# Altium project MODULIQ_PGA.PrjPcb (part 2 of 2)

## Sheet Power_Supply.SchDoc: PGA Supply
size A3; Author: M.Beldyga; CompanyName: WUT ISE; DrawnBy: M.Beldyga; Organization: WUT ISE; Address1: PW ISE; Address2: Nowowiejska 15/19 00-665 Warsaw; Address3: micbeldyga@gmail.com; SheetNumber: 3; SheetTotal: 3; ModifiedBy: -; CheckedDate: -; Title2: MODULIQ; DivGrp: WUT ISE; Designer: M.Beldyga; ModifiedDate: -; ProjectName: Sensor Box
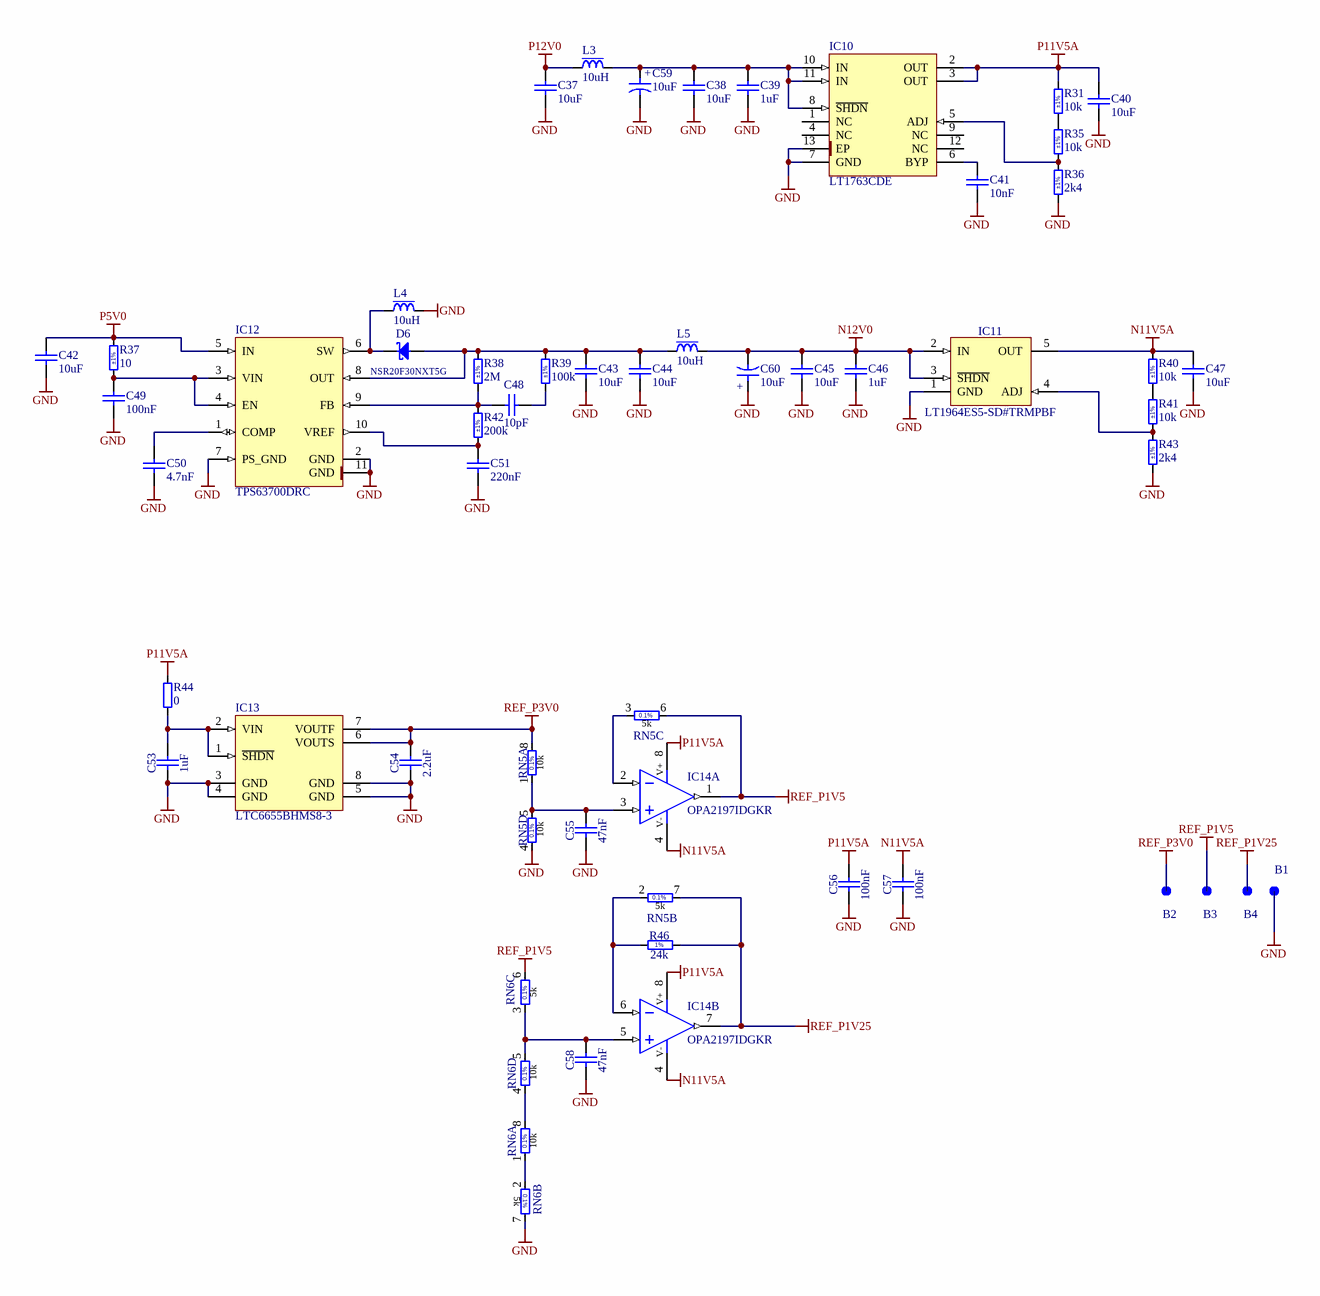
[diagram p2: Power_Supply.SchDoc]

### Parts
B1  SMD Pad  [C100]  (value not drawn)
B2  SMD Pad  [C100]  (value not drawn)
B3  SMD Pad  [C100]  (value not drawn)
B4  SMD Pad  [C100]  (value not drawn)
C37  10uF  [CAPC1709X100N]
C38  10uF  [CAPC1709X100N]
C39  1uF  [CAPC1608X87N]
C40  10uF  [CAPC1709X100N]
C41  10nF  [CAPC1005X55N]
C42  10uF  [CAPC1709X100N]
C43  10uF  [CAPC1709X100N]
C44  10uF  [CAPC1709X100N]
C45  10uF  [CAPC1709X100N]
C46  1uF  [CAPC1608X87N]
C47  10uF  [CAPC1709X100N]
C48  10pF  [CAPC1005X55N]
C49  100nF  [CAPC1005X55N]
C50  4.7nF  [CAPC1005X55N]
C51  220nF  [CAPC1005X55N]
C53  1uF  [CAPC1608X87N]
C54  2.2uF  [CAPC1608X87N]
C55  47nF  [CAPC2012X135N]
C56  100nF  [CAPC1005X55N]
C57  100nF  [CAPC1005X55N]
C58  47nF  [CAPC2012X135N]
C59  10uF  [CAPMP3216X180N]
C60  10uF  [CAPMP3216X180N]
D6  NSR20F30NXT5G  [DSN2]
IC10  LT1763CDE  [SON50P300X400X80-13N-R180X340]
IC11  LT1964ES5-SD#TRMPBF  [SOT95P280X100-5N]
IC12  TPS63700DRC  [TEXAS_DRC (S-PVSON-N10)]
IC13  LTC6655BHMS8-3  [SOP65P490X110-8N]
IC14  OPA2197IDGKR  [SOP65P490X110-8N]  (parts A,B of 2)
L3  10uH  [IND_WURTH_WE-TPC-2828]
L4  10uH  [IND_WURTH_WE-TPC-2828]
L5  10uH  [IND_WURTH_WE-TPC-2828]
R31  10k  Tolerance: ±1%  [RESC1005X40N]
R35  10k  Tolerance: ±1%  [RESC1005X40N]
R36  2k4  Tolerance: ±1%  [RESC1005X40N]
R37  10  Tolerance: ±1%  [RESC1005X40N]
R38  2M  Tolerance: ±1%  [RESC1005X40N]
R39  100k  Tolerance: ±1%  [RESC1005X40N]
R40  10k  Tolerance: ±1%  [RESC1005X40N]
R41  10k  Tolerance: ±1%  [RESC1005X40N]
R42  200k  Tolerance: ±1%  [RESC1005X40N]
R43  2k4  Tolerance: ±1%  [RESC1005X40N]
R44  0  [RESC1005X40N]
R46  24k  [RESC1608X55N]
RN5  10k 5K 5K 10K  [SOIC127P600X175-8N]  (value not drawn)  (parts A,B,C,D of 4)
RN6  10k 5K 5K 10K  [SOIC127P600X175-8N]  (value not drawn)  (parts A,B,C,D of 4)

### Nets
GND: B1.1 C37.1 C38.1 C39.1 C40.1 C41.1 C42.1 C43.1 C44.1 C45.1 C46.1 C47.1 C49.1 C50.1 C51.1 C53.1 C54.1 C55.1 C56.1 C57.1 C58.1 C59.2 C60.1 IC10.7(GND) IC10.13(EP) IC11.1(GND) IC12.2(GND) IC12.7(PS_GND) IC12.11(GND) IC13.3(GND) IC13.4(GND) IC13.5(GND) IC13.8(GND) L4.2 R36.1 R43.1 RN5.4 RN6.7
N11V5A: C47.2 C57.2 IC11.5(OUT) IC14.4(V-) R40.2
N12V0: C45.2 C46.2 C60.2 IC11.2(IN) IC11.3(~{SHDN}) L5.2
P5V0: C42.2 IC12.5(IN) R37.2
P11V5A: C40.2 C56.2 IC10.2(OUT) IC10.3(OUT) IC14.8(V+) R31.2 R44.1
P12V0: C37.2 L3.1
REF_P1V5: B3.1 IC14.1(OUT) RN5.6 RN6.6
REF_P1V25: B4.1 IC14.7(OUT) R46.2 RN5.7
REF_P3V0: B2.1 C54.2 IC13.6(VOUTS) IC13.7(VOUTF) RN5.8
NetC38_2: C38.2 C39.2 C59.1 IC10.8(~{SHDN}) IC10.10(IN) IC10.11(IN) L3.2
NetC41_2: C41.2 IC10.6(BYP)
NetC43_2: C43.2 C44.2 D6.2(A) IC12.8(OUT) L5.1 R38.1 R39.2
NetC48_1: C48.1 IC12.9(FB) R38.2 R42.2
NetC48_2: C48.2 R39.1
NetC49_2: C49.2 IC12.3(VIN) IC12.4(EN) R37.1
NetC50_2: C50.2 IC12.1(COMP)
NetC51_2: C51.2 IC12.10(VREF) R42.1
NetC53_2: C53.2 IC13.1(~{SHDN}) IC13.2(VIN) R44.2
NetC55_2: C55.2 IC14.3(IN+) RN5.1 RN5.5
NetC58_2: C58.2 IC14.5(IN+) RN6.3 RN6.5
NetD6_1: D6.1(C) IC12.6(SW) L4.1
NetIC10_5: IC10.5(ADJ) R35.1 R36.2
NetIC11_4: IC11.4(ADJ) R41.1 R43.2
NetIC14_2: IC14.2(IN-) RN5.3
NetIC14_6: IC14.6(IN-) R46.1 RN5.2
NetR31_1: R31.1 R35.2
NetR40_1: R40.1 R41.2
NetRN6_1: RN6.1 RN6.2
NetRN6_4: RN6.4 RN6.8

Not connected (* = marked no-connect by the designer): IC10 1(NC) 4(NC) 9(NC) 12(NC)

### Notes on the sheet
- Project/Equipment
- Document
- Designer
- Drawn by
- Check.by
- Contact
- File
- Last Mod.
- Print Date
- Sheet
- Size
- A3
- of
- Rev
- (in symbol CTE3216-18_10UF_16V_20%_AVX_TCJ) +
- (in symbol R0603_24K_1%_0.1W_100PPM) 1%
- (in symbol RN_10K_5K_VISHAY_AORN2-1AT3, part A) 10k
- (in symbol RN_10K_5K_VISHAY_AORN2-1AT3, part B) 5k
- (in symbol RN_10K_5K_VISHAY_AORN2-1AT3, part C) 5k
- (in symbol RN_10K_5K_VISHAY_AORN2-1AT3, part D) 10k

### Library data of the parts
B1-B4 = SMD_PAD_D1MM: Pad; Part Description: 1mm Diameter SMD Pad; Mounted: No; Part Number: SMD_PAD_D1MM; Component Kind: Standard (No BOM); Component Type: Standard (No BOM); Pin Count: 1; Family: SMD Pad; Socket: No; SMD: Yes; Sense: No; Status: None; ComponentHeight: 0mm; HelpURL: Undefined; Author: CERN DEM JLC; CreateDate: 10/10/2017; LatestRevisionDate: 10/10/2017; PackageDescription: 1mm Diameter SMD Pad
C37 C38 C40 C42-C45 C47 = CC0603_10UF_25V_20%_X5R: Non-polarised capacitor; Part Description: SMD Multilayer Chip Ceramic Capacitor; Manufacturer: GENERIC; Manufacturer1 Part Number: C1608X5R1E106M080; Voltage: 25V; TC: X5R; Tolerance: ±20%; Part Number: CC0603_10UF_25V_20%_X5R; Component Kind: Standard; Component Type: Standard; Pin Count: 2; Value: 10uF; Status: None; Manufacturer Part Number: CC0603_10UF_25V_20%_X5R; Case: 0603; Mounted: Yes; Socket: No; SMD: Yes; Sense: No; Manufacturer1 Example: TDK; Manufacturer1 ComponentHeight: 1mm; HelpURL: \\cern.ch\dfs\Applications\Altium\Datasheets\CC0603_X5R_TDK_C.pdf; Author: CERN DEM BC; CreateDate: 7/1/2020; LatestRevisionDate: 7/1/2020
C39 C46 C53 = CC0603_1UF_25V_10%_X7R: Non-polarised capacitor; Part Description: SMD Multilayer Chip Ceramic Capacitor; Manufacturer: GENERIC; Manufacturer1 Part Number: GRM188R71E105KA12D; Voltage: 25V; TC: X7R; Tolerance: ±10%; Part Number: CC0603_1UF_25V_10%_X7R; Component Kind: Standard; Component Type: Standard; Pin Count: 2; Value: 1uF; Status: None; Manufacturer Part Number: CC0603_1UF_25V_10%_X7R; Case: 0603; Mounted: Yes; Socket: No; SMD: Yes; Sense: No; Manufacturer1 Example: MURATA; Manufacturer1 ComponentHeight: 0.9mm; HelpURL: \\cern.ch\dfs\Applications\Altium\Datasheets\CC0603_X7R_MURATA.pdf; Author: CERN DEM JLC
  C39 C46: CreateDate: 1/18/2011; LatestRevisionDate: 1/18/2011
  C53: CreateDate: 18.01.2011; LatestRevisionDate: 18.01.2011
C41 = CC0402_10NF_50V_5%_X7R: Non-polarised capacitor; Part Description: SMD Multilayer Chip Ceramic Capacitor; Manufacturer: GENERIC; Manufacturer1 Part Number: C0402C103J5RAC; Voltage: 50V; TC: X7R; Tolerance: ±5%; Part Number: CC0402_10NF_50V_5%_X7R; Component Kind: Standard; Component Type: Standard; Pin Count: 2; Value: 10nF; Status: Preferred; Manufacturer Part Number: CC0402_10NF_50V_5%_X7R; Case: 0402; Mounted: Yes; Socket: No; SMD: Yes; Sense: No; Manufacturer1 Example: KEMET; Manufacturer1 ComponentHeight: 0.55mm; HelpURL: \\cern.ch\dfs\Applications\Altium\Datasheets\CC0402_X7R_KEMET.pdf; Author: CERN DEM BC; CreateDate: 7/15/2020; LatestRevisionDate: 7/15/2020
C48 = CC0402_10PF_50V_5%_C0G: Non-polarised capacitor; Part Description: SMD Multilayer Chip Ceramic Capacitor; Manufacturer: GENERIC; Manufacturer1 Part Number: C0402C100J5GACTU; Voltage: 50V; TC: C0G/NP0; Tolerance: ±5%; Part Number: CC0402_10PF_50V_5%_C0G; Component Kind: Standard; Component Type: Standard; Pin Count: 2; Value: 10pF; Status: Preferred; Manufacturer Part Number: CC0402_10PF_50V_5%_C0G; Case: 0402; Mounted: Yes; Socket: No; SMD: Yes; Sense: No; Manufacturer1 Example: KEMET; Manufacturer1 ComponentHeight: 0.55mm; HelpURL: \\cern.ch\dfs\Applications\Altium\Datasheets\CC0402_C0G_KEMET_(Commercial Grade).pdf; Author: CERN DEM JLC; CreateDate: 12/3/2007; LatestRevisionDate: 4/22/2015
C49 = CC0402_100NF_50V_10%_X7R: Non-polarised capacitor; Part Description: SMD Multilayer Chip Ceramic Capacitor; Manufacturer: GENERIC; Manufacturer1 Part Number: GRM155R71H104KE14D; Voltage: 50V; TC: X7R; Tolerance: ±10%; Part Number: CC0402_100NF_50V_10%_X7R; Component Kind: Standard; Component Type: Standard; Pin Count: 2; Value: 100nF; Status: None; Manufacturer Part Number: CC0402_100NF_50V_10%_X7R; Case: 0402; Mounted: Yes; Socket: No; SMD: Yes; Sense: No; Manufacturer1 Example: MURATA; Manufacturer1 ComponentHeight: 0.55mm; HelpURL: \\cern.ch\dfs\Applications\Altium\Datasheets\CC0402_MURATA_GRM155R71H104KE14D.pdf; Author: CERN DEM MR; CreateDate: 6/30/2017; LatestRevisionDate: 6/30/2017
C50 = CC0402_4.7NF_16V_10%_X7R: Non-polarised capacitor; Part Description: SMD Multilayer Chip Ceramic Capacitor; Manufacturer: GENERIC; Manufacturer1 Part Number: 223878715632; Voltage: 16V; TC: X7R; Tolerance: ±10%; Part Number: CC0402_4.7NF_16V_10%_X7R; Component Kind: Standard; Component Type: Standard; Pin Count: 2; Value: 4.7nF; Status: Not Recommended; Manufacturer Part Number: CC0402_4.7NF_16V_10%_X7R; Case: 0402; Mounted: Yes; Socket: No; SMD: Yes; Sense: No; Manufacturer1 Example: PHYCOMP; Manufacturer1 ComponentHeight: 0.55mm; HelpURL: \\cern.ch\dfs\Applications\Altium\Datasheets\CC0402_X7R_PHYCOMP.pdf; Author: CERN DEM JLC; CreateDate: 12/3/2007; LatestRevisionDate: 12/3/2007
C51 = CC0402_220NF_35V_10%_X7R: Non-polarised capacitor; Part Description: SMD Multilayer Chip Ceramic Capacitor; Manufacturer: GENERIC; Manufacturer1 Part Number: CGA2B1X7R1V224K050; Voltage: 35V; TC: X7R; Tolerance: ±10%; Part Number: CC0402_220NF_35V_10%_X7R; Component Kind: Standard; Component Type: Standard; Pin Count: 2; Value: 220nF; Status: None; Manufacturer Part Number: CC0402_220NF_35V_10%_X7R; Case: 0402; Mounted: Yes; Socket: No; SMD: Yes; Sense: No; Manufacturer1 Example: TDK; Manufacturer1 ComponentHeight: 0.55mm; HelpURL: \\cern.ch\dfs\Applications\Altium\Datasheets\CC0402_X7R_TDK_CGA.pdf; Author: CERN DEM HF; CreateDate: 11/9/2023; LatestRevisionDate: 11/9/2023
C54 = CC0603_2.2UF_16V_10%_X5R: Non-polarised capacitor; Part Description: SMD Multilayer Chip Ceramic Capacitor; Manufacturer: GENERIC; Manufacturer1 Part Number: CC0603KRX5R7BB225; Voltage: 16V; TC: X5R; Tolerance: ±10%; Part Number: CC0603_2.2UF_16V_10%_X5R; Component Kind: Standard; Component Type: Standard; Pin Count: 2; Value: 2.2uF; Status: Preferred; Manufacturer Part Number: CC0603_2.2UF_16V_10%_X5R; Case: 0603; Mounted: Yes; Socket: No; SMD: Yes; Sense: No; Manufacturer1 Example: YAGEO; Manufacturer1 ComponentHeight: 0.9mm; HelpURL: \\cern.ch\dfs\Applications\Altium\Datasheets\CC0805_X5R_PHYCOMP_HC.pdf; Author: CERN DEM JLC; CreateDate: 28.04.2011; LatestRevisionDate: 28.04.2011
C55 C58 = CC0805_47NF_25V_5%_C0G: Non-polarised capacitor; Part Description: SMD Multilayer Chip Ceramic Capacitor; Manufacturer: GENERIC; Manufacturer1 Part Number: C0805C473J3GACTU; Voltage: 25V; TC: C0G/NP0; Tolerance: ±5%; Part Number: CC0805_47NF_25V_5%_C0G; Component Kind: Standard; Component Type: Standard; Pin Count: 2; Value: 47nF; Status: None; Manufacturer Part Number: CC0805_47NF_25V_5%_C0G; Case: 0805; Mounted: Yes; Socket: No; SMD: Yes; Sense: No; Manufacturer1 Example: KEMET; Manufacturer1 ComponentHeight: 1.4mm; HelpURL: \\cern.ch\dfs\Applications\Altium\Datasheets\CC0805_C0G_KEMET_(Commercial Grade).pdf; Author: CERN DEM JLC; CreateDate: 18.01.2011; LatestRevisionDate: 18.01.2011
C56 C57 = CC0402_100NF_16V_10%_X5R: Non-polarised capacitor; Part Description: SMD Multilayer Chip Ceramic Capacitor; Manufacturer: GENERIC; Manufacturer1 Part Number: GRM155R61C104KA88D; Voltage: 16V; TC: X5R; Tolerance: ±10%; Part Number: CC0402_100NF_16V_10%_X5R; Component Kind: Standard; Component Type: Standard; Pin Count: 2; Value: 100nF; Status: None; Manufacturer Part Number: CC0402_100NF_16V_10%_X5R; Case: 0402; Mounted: Yes; Socket: No; SMD: Yes; Sense: No; Manufacturer1 Example: MURATA; Manufacturer1 ComponentHeight: 0.55mm; HelpURL: \\cern.ch\dfs\Applications\Altium\Datasheets\CC0402_X5R_MURATA_GRM.pdf; Author: CERN DEM JLC; CreateDate: 10.12.2013; LatestRevisionDate: 10.12.2013
C59 C60 = CTE3216-18_10UF_16V_20%_AVX_TCJ: Polarised capacitor; Part Description: ESR 0R200 Tantalum Solid Electrolytic Chip Capacitor with Conductive Polymer Electrode; Manufacturer: AVX; Manufacturer Part Number: TCJA106M016R0200; Voltage: 16V; Tolerance: ±20%; Part Number: CTE3216-18_10UF_16V_20%_AVX_TCJ; Component Kind: Standard; Component Type: Standard; Pin Count: 2; Value: 10uF; Status: Preferred; Case: A; Mounted: Yes; Socket: No; SMD: Yes; Sense: No; ComponentHeight: 1.8mm; HelpURL: \\cern.ch\dfs\Applications\Altium\Datasheets\CTE_AVX_TCJ.pdf; Author: CERN DEM JLC; CreateDate: 29.03.2012; LatestRevisionDate: 29.03.2012
D6 = NSR20F30NXT5G: Schottky Diode; Part Description: Diode 30 V 2A Surface Mount 2-DSN (1.6x.80); Manufacturer: onsemi; Arena Part Number: 140-000035; Part Number: NSR20F30NXT5G; Component Kind: Standard; Component Type: Standard; Device: NSR20F30NXT5G; PackageDescription: 1.6x0.8, 0.9P, (0603) CASE 152AB; Manufacturer Part Number: NSR20F30NXT5G; Pin Count: 2; Case: DSN2; Status: Active; Author: Michal Beldyga; CreateDate: 8/5/2025; LastRevision: 8/8/2025
IC10 = LT1763CDE: 1.22V to 20V 500mA, Low Noise, LDO Adjustable Micropower Regulator; Part Description: 1.22V to 20V, 500mA, Low Noise, LDO Adjustable Micropower Regulator; Manufacturer: LINEAR TECHNOLOGY; PressFit: No; Bonding: No; Part Number: LT1763CDE; Component Kind: Standard; Component Type: Standard; Device: LT1763CDE; PackageDescription: SON, (DFN) 0.50mm Pitch; 12 Pin, 3.00mm W X 4.00mm L X 0.80mm H body (w/Thermal Tab 1.80 X 3.40mm), IPC Medium Density; Manufacturer Part Number: LT1763CDE; Pin Count: 13; Case: SON12; Mounted: Yes; Socket: No; SMD: Yes; Sense: No; ComponentHeight: 0.8mm; HelpURL: \\cern.ch\dfs\Applications\Altium\Datasheets\LT1763.pdf; Author: CERN DEM HF; CreateDate: 4/25/2023; LatestRevisionDate: 4/25/2023
IC11 = LT1964ES5-SD#TRMPBF: 200mA, Low Noise, Low Dropout Negative Micropower Regulator; Part Description: -1.22V to -20V, 200mA, Low Noise, Low Dropout Negative Micropower Regulator; Manufacturer: LINEAR TECHNOLOGY; PressFit: No; Bonding: No; Part Number: LT1964ES5-SD#TRMPBF; Component Kind: Standard; Component Type: Standard; Device: LT1964ES5-SD#TRMPBF; PackageDescription: SOT23, 0.95mm pitch; 5 pin, 1.75mm W X 3.00mm L, IPC Medium Density; Manufacturer Part Number: LT1964ES5-SD#TRMPBF; Pin Count: 5; Case: SOT23-5; Mounted: Yes; Socket: No; SMD: Yes; Sense: No; ComponentHeight: 1mm; HelpURL: \\cern.ch\dfs\Applications\Altium\Datasheets\LT1964ES5-SD#TRMPBF.pdf; Author: CERN DEM JLC; CreateDate: 05.05.2009; LatestRevisionDate: 05.05.2009
IC12 = TPS63700DRC: DC-DC Inverter; Manufacturer: TEXAS INSTRUMENTS; PressFit: No; Bonding: No; Part Number: TPS63700DRC; Component Kind: Standard; Component Type: Standard; Device: TPS63700DRC; PackageDescription: TEXAS Case Style DRC (S-PVSON-N10), SON, 0.50mm Pitch; 10 Pin, 3.00mm W  X 3.00mm L X 1.00mm H body, (w/Thermal Tab 1.75 X 2.50 mm); Part Description: DC-DC Inverter; Manufacturer Part Number: TPS63700DRC; Pin Count: 11; Case: SON10; Mounted: Yes; Socket: No; SMD: Yes; Sense: No; ComponentHeight: 1mm; HelpURL: \\cern.ch\dfs\Applications\Altium\Datasheets\TPS63700DRC.pdf; Author: CERN DEM BC; CreateDate: 5/18/2020; LatestRevisionDate: 5/18/2020
IC13 = LTC6655BHMS8-3: 0.25ppm Noise, Low Drift Precision Buffered Voltage Reference; Part Description: 3V, 0.25ppm Noise, Low Drift Precision Buffered Voltage Reference; Manufacturer: ANALOG DEVICES; PressFit: No; Bonding: No; Part Number: LTC6655BHMS8-3; Component Kind: Standard; Component Type: Standard; Device: LTC6655BHMS8-3; PackageDescription: SOP, 8-Leads, Body 3.1x3.1mm (max), Pitch 0.65mm, IPC Medium Density; Manufacturer Part Number: LTC6655BHMS8-3; Pin Count: 8; Case: SSOP8; Mounted: Yes; Socket: No; SMD: Yes; Sense: No; ComponentHeight: 1.1mm; HelpURL: \\cern.ch\dfs\Applications\Altium\Datasheets\LTC6655BHMS8-3.pdf; Author: CERN DEM HF; CreateDate: 12/13/2021; LatestRevisionDate: 12/13/2021
IC14 = OA_OPA2197IDGKR: 36-V, Precision, Rail-to-Rail Input Output, Low Offset Voltage Op Amp 8-VSSOP; Part Description: High-Precision, Low-Noise, Rail-to-Rail Output,10-MHz Op Amp; Manufacturer: TEXAS INSTRUMENTS; PressFit: No; Bonding: No; Part Number: OPA2197IDGKR; Component Kind: Standard; Component Type: Standard; Device: OPA2197IDGKR; PackageDescription: SOP, 0.65mm pitch; 8 pin, 3.00mm W X 3.00mm L X 1.10mm H body, IPC Medium Density; Manufacturer Part Number: OPA2197IDGKR; Pin Count: 8; Case: MSOP8; Mounted: Yes; Socket: No; SMD: Yes; Sense: No; ComponentHeight: 1.1mm; Author: GK; HelpURL: \\cern.ch\dfs\Applications\Altium\Datasheets\OPA2140AIDGK.pdf; CreateDate: 20.04.2017; LatestRevisionDate: 20.04.2017
L3-L5 = IND_10UH_20%_WURTH_WE-TPC_744025100: Inductor With Core; Part Description: Shielded Tiny Power Inductor (WE-TPC Series); Manufacturer: WURTH ELEKTRONIK; Power: 1A; Resistance: 0.17R; Tolerance: ±20%; Part Number: IND_10UH_20%_WURTH_WE-TPC_744025100; Component Kind: Standard; Component Type: Standard; Pin Count: 2; Value: 10uH; Manufacturer Part Number: 744025100; Mounted: Yes; Socket: No; SMD: Yes; Sense: No; ComponentHeight: 3mm; HelpURL: \\cern.ch\dfs\Applications\Altium\Datasheets\IND_WURTH_WE-TPC_744025100.pdf; Author: CERN DEM BC; CreateDate: 7/29/2020; LatestRevisionDate: 7/29/2020
R31 R35 R40 R41 = R0402_10K_1%_0.0625W_100PPM: Resistor - 1%; Part Description: General Purpose Thick Film Chip Resistor; Manufacturer: GENERIC; Manufacturer1 Part Number: 232270671003L; TC: ±100ppm/°C; PressFit: No; Part Number: R0402_10K_1%_0.0625W_100PPM; Component Kind: Standard; Component Type: Standard; Pin Count: 2; Value: 10k; Status: Not Recommended; Power: 0.0625W; Manufacturer Part Number: R0402_10K_1%_0.0625W_100PPM; Case: 0402; Mounted: Yes; Sense: No; Socket: No; SMD: Yes; Manufacturer1 Example: YAGEO PHYCOMP; Manufacturer1 ComponentHeight: 0.4mm; HelpURL: \\cern.ch\dfs\Applications\Altium\Datasheets\R0402_Phycomp_RC0402.pdf; Author: CERN DEM JLC; CreateDate: 12/3/2007; LatestRevisionDate: 10/17/2012
R36 R43 = R0402_2K4_1%_0.0625W_100PPM: Resistor - 1%; Part Description: General Purpose Thick Film Chip Resistor; Manufacturer: GENERIC; Manufacturer1 Part Number: 232270672402L; TC: ±100ppm/°C; PressFit: No; Part Number: R0402_2K4_1%_0.0625W_100PPM; Component Kind: Standard; Component Type: Standard; Pin Count: 2; Value: 2k4; Status: Not Recommended; Power: 0.0625W; Manufacturer Part Number: R0402_2K4_1%_0.0625W_100PPM; Case: 0402; Mounted: Yes; Sense: No; Socket: No; SMD: Yes; Manufacturer1 Example: YAGEO PHYCOMP; Manufacturer1 ComponentHeight: 0.4mm; HelpURL: \\cern.ch\dfs\Applications\Altium\Datasheets\R0402_Phycomp_RC0402.pdf; Author: CERN DEM JLC; CreateDate: 12/3/2007; LatestRevisionDate: 10/17/2012
R37 = R0402_10R_1%_0.0625W_200PPM: Resistor - 1%; Part Description: General Purpose Thick Film Chip Resistor; Manufacturer: GENERIC; Manufacturer1 Part Number: 232270671009L; TC: ±200ppm/°C; PressFit: No; Part Number: R0402_10R_1%_0.0625W_200PPM; Component Kind: Standard; Component Type: Standard; Pin Count: 2; Value: 10; Status: Not Recommended; Power: 0.0625W; Manufacturer Part Number: R0402_10R_1%_0.0625W_200PPM; Case: 0402; Mounted: Yes; Sense: No; Socket: No; SMD: Yes; Manufacturer1 Example: YAGEO PHYCOMP; Manufacturer1 ComponentHeight: 0.4mm; HelpURL: \\cern.ch\dfs\Applications\Altium\Datasheets\R0402_Phycomp_RC0402.pdf; Author: CERN DEM JLC; CreateDate: 6/24/2009; LatestRevisionDate: 10/17/2012
R38 = R0402_2M_1%_0.0625W_100PPM: Resistor - 1%; Part Description: General Purpose Thick Film Chip Resistor; Manufacturer: GENERIC; Manufacturer1 Part Number: 232270672005L; TC: ±100ppm/°C; PressFit: No; Part Number: R0402_2M_1%_0.0625W_100PPM; Component Kind: Standard; Component Type: Standard; Pin Count: 2; Value: 2M; Status: Not Recommended; Power: 0.0625W; Manufacturer Part Number: R0402_2M_1%_0.0625W_100PPM; Case: 0402; Mounted: Yes; Sense: No; Socket: No; SMD: Yes; Manufacturer1 Example: YAGEO PHYCOMP; Manufacturer1 ComponentHeight: 0.4mm; HelpURL: \\cern.ch\dfs\Applications\Altium\Datasheets\R0402_Phycomp_RC0402.pdf; Author: CERN DEM JLC; CreateDate: 12/3/2007; LatestRevisionDate: 10/17/2012
R39 = R0402_100K_1%_0.0625W_100PPM: Resistor - 1%; Part Description: General Purpose Thick Film Chip Resistor; Manufacturer: GENERIC; Manufacturer1 Part Number: 232270671004L; TC: ±100ppm/°C; PressFit: No; Part Number: R0402_100K_1%_0.0625W_100PPM; Component Kind: Standard; Component Type: Standard; Pin Count: 2; Value: 100k; Status: Not Recommended; Power: 0.0625W; Manufacturer Part Number: R0402_100K_1%_0.0625W_100PPM; Case: 0402; Mounted: Yes; Sense: No; Socket: No; SMD: Yes; Manufacturer1 Example: YAGEO PHYCOMP; Manufacturer1 ComponentHeight: 0.4mm; HelpURL: \\cern.ch\dfs\Applications\Altium\Datasheets\R0402_Phycomp_RC0402.pdf; Author: CERN DEM JLC; CreateDate: 12/3/2007; LatestRevisionDate: 10/17/2012
R42 = R0402_200K_1%_0.0625W_100PPM: Resistor - 1%; Part Description: General Purpose Thick Film Chip Resistor; Manufacturer: GENERIC; Manufacturer1 Part Number: 232270672004L; TC: ±100ppm/°C; PressFit: No; Part Number: R0402_200K_1%_0.0625W_100PPM; Component Kind: Standard; Component Type: Standard; Pin Count: 2; Value: 200k; Status: Not Recommended; Power: 0.0625W; Manufacturer Part Number: R0402_200K_1%_0.0625W_100PPM; Case: 0402; Mounted: Yes; Sense: No; Socket: No; SMD: Yes; Manufacturer1 Example: YAGEO PHYCOMP; Manufacturer1 ComponentHeight: 0.4mm; HelpURL: \\cern.ch\dfs\Applications\Altium\Datasheets\R0402_Phycomp_RC0402.pdf; Author: CERN DEM JLC; CreateDate: 12/3/2007; LatestRevisionDate: 10/17/2012
R44 = R0402_0R_JUMPER: Resistor; Part Description: 1A (0.05R Max DC Resistance) Zero Ohm Jumper; Manufacturer: GENERIC; Manufacturer1 Part Number: 232270591001L; Part Number: R0402_0R_JUMPER; Component Kind: Standard; Component Type: Standard; Pin Count: 2; Value: 0; Status: Not recommended; Manufacturer Part Number: R0402_0R_JUMPER; Case: 0402; Mounted: Yes; Sense: No; Socket: No; SMD: Yes; Manufacturer1 Example: YAGEO PHYCOMP; Manufacturer1 ComponentHeight: 0.4mm; HelpURL: \\cern.ch\dfs\Applications\Altium\Datasheets\R0402_Phycomp_RC0402.pdf; Author: CERN DEM JLC; CreateDate: 03.12.2007; LatestRevisionDate: 17.10.2012
R46 = R0603_24K_1%_0.1W_100PPM: Resistor - 1%; Part Description: General Purpose Thick Film Chip Resistor; Manufacturer: GENERIC; Manufacturer1 Part Number: NRC06F2402TRF; Power: 0.1W; TC: ±100ppm/°C; PressFit: No; Part Number: R0603_24K_1%_0.1W_100PPM; Component Kind: Standard; Component Type: Standard; Pin Count: 2; Value: 24k; Status: Preferred; Tolerance: ±1%; Manufacturer Part Number: R0603_24K_1%_0.1W_100PPM; Case: 0603; Mounted: Yes; Sense: No; Socket: No; SMD: Yes; Manufacturer1 Example: NIC COMPONENT; Manufacturer1 ComponentHeight: 0.55mm; HelpURL: \\cern.ch\dfs\Applications\Altium\Datasheets\R0603_NIC_NRC.pdf; Author: CERN DEM JLC; CreateDate: 03.12.2007; LatestRevisionDate: 13.03.2008
RN5 RN6 = RN_10K_5K_VISHAY_AORN2-1AT3: DIL8 Resistor Network 4 Resistors 10k-5k-5k-10k 0.1%; Part Description: Dual-In-Line Thin Film Precision Automotive Resistors Network, (4 Isolated) - AORN Series; Manufacturer: VISHAY DALE; Power: 4x0.1W; TC: ±25ppm/°C; PressFit: No; Part Number: RN_10K_5K_VISHAY_AORN2-1AT3; Component Kind: Standard; Component Type: Standard; Pin Count: 8; Value: 10k 5K 5K 10K; Sense: No; Tolerance: 0.1%; Manufacturer Part Number: AORN2-1AT3; Case: SOIC8; Mounted: Yes; Socket: No; SMD: Yes; ComponentHeight: 1.73mm; HelpURL: \\cern.ch\dfs\Applications\Altium\Datasheets\RN_VISHAY_AORN.pdf; Author: CERN DEM JLC; CreateDate: 20.02.2017; LatestRevisionDate: 20.02.2017

## Nets that join several sheets
GND: MODULIQ_PGA (40 pins), SPI_IFC (53 pins), Power_Supply (38 pins)
N11V5A: MODULIQ_PGA (16 pins), Power_Supply (5 pins)
P3V3: MODULIQ_PGA (LD2.2 LD3.2 R52.1 R53.1), SPI_IFC (16 pins)
P5V0: SPI_IFC (10 pins), Power_Supply (C42.2 IC12.5 R37.2)
P11V5A: MODULIQ_PGA (14 pins), Power_Supply (7 pins)
P12V0: SPI_IFC (6 pins), Power_Supply (C37.2 L3.1)
REF_P1V5: MODULIQ_PGA (R14.1 R30.1), Power_Supply (B3.1 IC14.1 RN5.6 RN6.6)
REF_P1V25: MODULIQ_PGA (6 pins), Power_Supply (B4.1 IC14.7 R46.2 RN5.7)
CH1_A0: MODULIQ_PGA (IC2.4), SPI_IFC (IC3.37)
CH1_A1: MODULIQ_PGA (IC2.5), SPI_IFC (IC3.42)
CH1_TERM_EN: MODULIQ_PGA (R6.1 T1.1), SPI_IFC (IC3.43)
CH2_A0: MODULIQ_PGA (IC8.4), SPI_IFC (IC3.35)
CH2_A1: MODULIQ_PGA (IC8.5), SPI_IFC (IC3.34)
CH2_TERM_EN: MODULIQ_PGA (R20.1 T2.1), SPI_IFC (IC3.36)
SPI_CS2: MODULIQ_PGA (R53.2), SPI_IFC (IC3.52)
SPI_CS3: MODULIQ_PGA (R52.2), SPI_IFC (IC3.53)